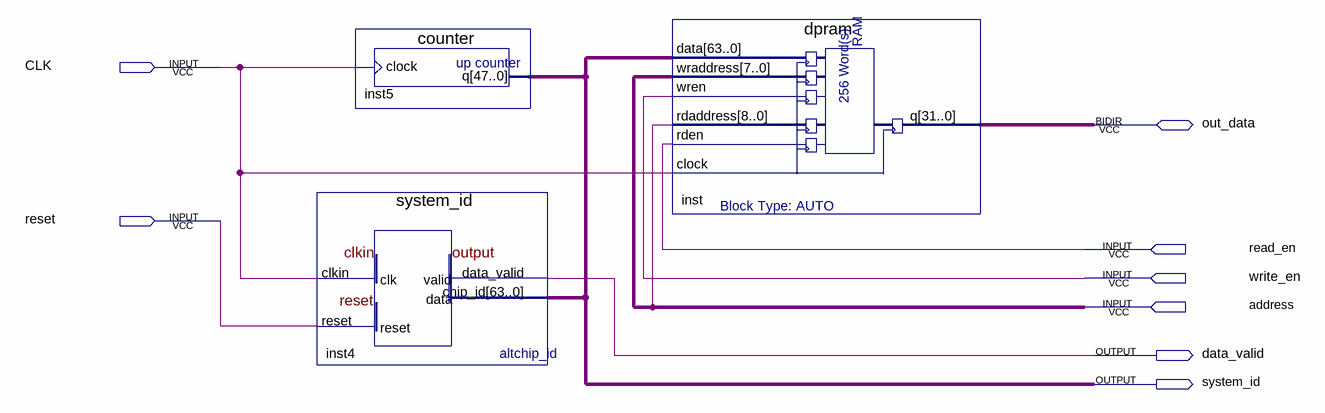
[diagram p0: schematic sheet]
// Quartus schematic szkic_.bdf as structural Verilog: 3 symbols, 8 pins
module szkic_ (
  input  CLK,
  input  reset,
  input  read_en,
  input  write_en,
  input  address,
  inout  out_data,
  output data_valid,
  output system_id
);

  wire undriven;
  wire [7:0] undriven_2;
  wire [31:0] inst_q;
  wire [63:0] inst4_chip_id;

  system_id inst4 (.clkin(CLK), .reset(reset), .data_valid(data_valid), .chip_id(inst4_chip_id));
  counter inst5 (.clock(CLK), .q(inst4_chip_id));
  dpram inst (
    .data(inst4_chip_id), .wraddress(undriven_2), .wren(write_en), .rdaddress({9{undriven}}), .rden(read_en),
    .clock(CLK), .q(inst_q));
endmodule
